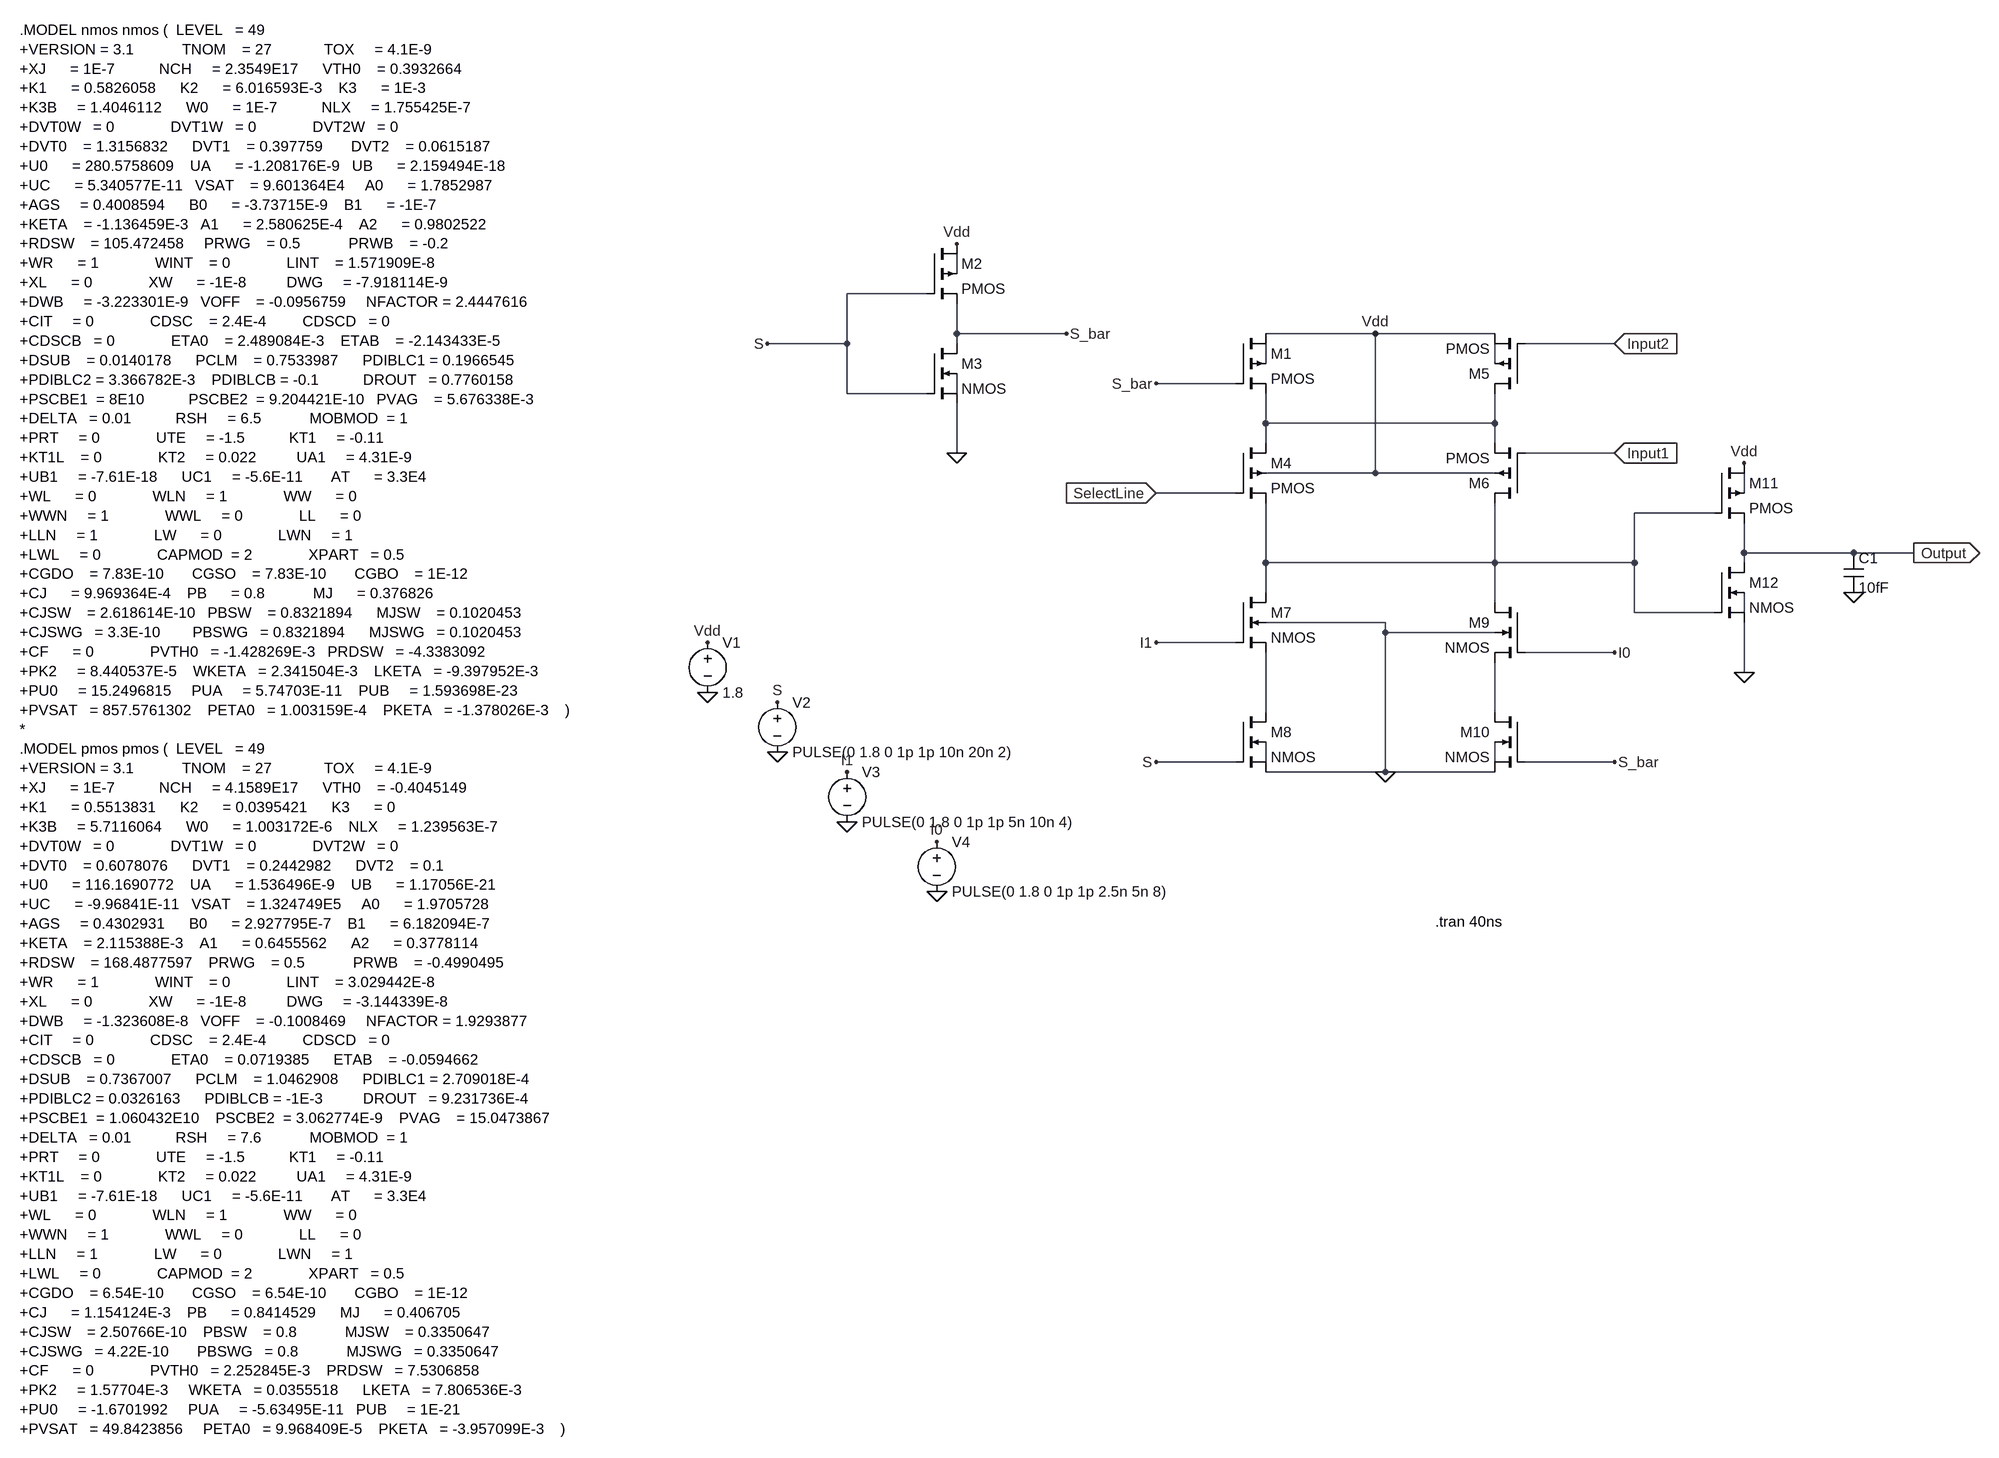
[diagram p0: schematic mux21.asc]
mux21.asc, the LTspice schematic file:
Version 4
SHEET 1 3156 1872
WIRE 528 -128 528 -160
WIRE 480 -96 352 -96
WIRE 528 -32 528 -80
WIRE 704 -32 528 -32
WIRE 1200 -32 1024 -32
WIRE 1392 -32 1200 -32
WIRE 352 -16 352 -96
WIRE 352 -16 224 -16
WIRE 528 -16 528 -32
WIRE 1584 -16 1440 -16
WIRE 1024 16 1024 -16
WIRE 1392 16 1392 -16
WIRE 976 48 848 48
WIRE 352 64 352 -16
WIRE 480 64 352 64
WIRE 528 64 528 32
WIRE 1024 112 1024 64
WIRE 1392 112 1392 64
WIRE 1392 112 1024 112
WIRE 1024 144 1024 112
WIRE 1392 144 1392 112
WIRE 528 160 528 80
WIRE 1584 160 1440 160
WIRE 1200 192 1200 -32
WIRE 1200 192 1024 192
WIRE 1392 192 1200 192
WIRE 976 224 848 224
WIRE 1792 224 1792 192
WIRE 1744 256 1616 256
WIRE 1792 320 1792 272
WIRE 1968 320 1792 320
WIRE 2064 320 1968 320
WIRE 1024 336 1024 240
WIRE 1392 336 1392 240
WIRE 1392 336 1024 336
WIRE 1616 336 1616 256
WIRE 1616 336 1392 336
WIRE 1792 336 1792 320
WIRE 1024 384 1024 336
WIRE 1392 400 1392 336
WIRE 1616 416 1616 336
WIRE 1744 416 1616 416
WIRE 1792 416 1792 384
WIRE 1216 432 1024 432
WIRE 1216 448 1216 432
WIRE 1392 448 1216 448
WIRE 976 464 848 464
WIRE 1584 480 1440 480
WIRE 1792 512 1792 432
WIRE 1024 576 1024 480
WIRE 1392 576 1392 496
WIRE 976 656 848 656
WIRE 1024 656 1024 624
WIRE 1392 656 1392 624
WIRE 1584 656 1440 656
WIRE 1216 672 1216 448
WIRE 1216 672 1024 672
WIRE 1392 672 1216 672
FLAG 528 160 0
FLAG 224 -16 S
FLAG 704 -32 S_bar
FLAG 528 -176 Vdd
FLAG 1968 384 0
FLAG 1216 672 0
FLAG 848 656 S
FLAG 848 464 I1
FLAG 1200 -32 Vdd
FLAG 848 48 S_bar
FLAG 1584 656 S_bar
FLAG 1584 480 I0
FLAG 1792 512 0
FLAG 1792 176 Vdd
FLAG 128 544 0
FLAG 240 640 0
FLAG 352 752 0
FLAG 496 864 0
FLAG 128 464 Vdd
FLAG 240 560 S
FLAG 352 672 I1
FLAG 496 784 I0
FLAG 1584 160 Input1
IOPIN 1584 160 In
FLAG 1584 -16 Input2
IOPIN 1584 -16 In
FLAG 2064 320 Output
IOPIN 2064 320 Out
FLAG 848 224 SelectLine
IOPIN 848 224 In
SYMBOL voltage 128 448 R0
SYMATTR InstName V1
SYMATTR Value 1.8
SYMBOL voltage 240 544 R0
SYMATTR InstName V2
SYMATTR Value PULSE(0 1.8 0 1p 1p 10n 20n 2)
SYMBOL voltage 352 656 R0
SYMATTR InstName V3
SYMATTR Value PULSE(0 1.8 0 1p 1p 5n 10n 4)
SYMBOL pmos4 480 -176 R0
SYMATTR InstName M2
SYMATTR Value2 l=180n w=360n
SYMBOL nmos4 480 -16 R0
SYMATTR InstName M3
SYMATTR Value2 l=180n w=360n
SYMBOL pmos4 976 -32 R0
SYMATTR InstName M1
SYMATTR Value2 l=180n w=360n
SYMBOL pmos4 976 144 R0
SYMATTR InstName M4
SYMATTR Value2 l=180n w=360n
SYMBOL pmos4 1440 64 R180
SYMATTR InstName M5
SYMATTR Value2 l=180n w=360n
SYMBOL pmos4 1440 240 R180
SYMATTR InstName M6
SYMATTR Value2 l=180n w=360n
SYMBOL nmos4 976 384 R0
SYMATTR InstName M7
SYMATTR Value2 l=180n w=360n
SYMBOL nmos4 976 576 R0
SYMATTR InstName M8
SYMATTR Value2 l=180n w=360n
SYMBOL nmos4 1440 400 M0
SYMATTR InstName M9
SYMATTR Value2 l=180n w=360n
SYMBOL nmos4 1440 576 M0
SYMATTR InstName M10
SYMATTR Value2 l=180n w=360n
SYMBOL cap 1952 320 R0
SYMATTR InstName C1
SYMATTR Value 10fF
SYMBOL pmos4 1744 176 R0
SYMATTR InstName M11
SYMATTR Value2 l=180n w=360n
SYMBOL nmos4 1744 336 R0
SYMATTR InstName M12
SYMATTR Value2 l=180n w=360n
SYMBOL voltage 496 768 R0
SYMATTR InstName V4
SYMATTR Value PULSE(0 1.8 0 1p 1p 2.5n 5n 8)
TEXT 1296 912 Left 2 !.tran 40ns
TEXT -976 -520 Left 2 !.MODEL nmos nmos (  LEVEL   = 49\n+VERSION = 3.1            TNOM    = 27             TOX     = 4.1E-9\n+XJ      = 1E-7           NCH     = 2.3549E17      VTH0    = 0.3932664\n+K1      = 0.5826058      K2      = 6.016593E-3    K3      = 1E-3\n+K3B     = 1.4046112      W0      = 1E-7           NLX     = 1.755425E-7\n+DVT0W   = 0              DVT1W   = 0              DVT2W   = 0\n+DVT0    = 1.3156832      DVT1    = 0.397759       DVT2    = 0.0615187\n+U0      = 280.5758609    UA      = -1.208176E-9   UB      = 2.159494E-18\n+UC      = 5.340577E-11   VSAT    = 9.601364E4     A0      = 1.7852987\n+AGS     = 0.4008594      B0      = -3.73715E-9    B1      = -1E-7\n+KETA    = -1.136459E-3   A1      = 2.580625E-4    A2      = 0.9802522\n+RDSW    = 105.472458     PRWG    = 0.5            PRWB    = -0.2\n+WR      = 1              WINT    = 0              LINT    = 1.571909E-8\n+XL      = 0              XW      = -1E-8          DWG     = -7.918114E-9\n+DWB     = -3.223301E-9   VOFF    = -0.0956759     NFACTOR = 2.4447616\n+CIT     = 0              CDSC    = 2.4E-4         CDSCD   = 0\n+CDSCB   = 0              ETA0    = 2.489084E-3    ETAB    = -2.143433E-5\n+DSUB    = 0.0140178      PCLM    = 0.7533987      PDIBLC1 = 0.1966545\n+PDIBLC2 = 3.366782E-3    PDIBLCB = -0.1           DROUT   = 0.7760158\n+PSCBE1  = 8E10           PSCBE2  = 9.204421E-10   PVAG    = 5.676338E-3\n+DELTA   = 0.01           RSH     = 6.5            MOBMOD  = 1\n+PRT     = 0              UTE     = -1.5           KT1     = -0.11\n+KT1L    = 0              KT2     = 0.022          UA1     = 4.31E-9\n+UB1     = -7.61E-18      UC1     = -5.6E-11       AT      = 3.3E4\n+WL      = 0              WLN     = 1              WW      = 0\n+WWN     = 1              WWL     = 0              LL      = 0\n+LLN     = 1              LW      = 0              LWN     = 1\n+LWL     = 0              CAPMOD  = 2              XPART   = 0.5\n+CGDO    = 7.83E-10       CGSO    = 7.83E-10       CGBO    = 1E-12\n+CJ      = 9.969364E-4    PB      = 0.8            MJ      = 0.376826\n+CJSW    = 2.618614E-10   PBSW    = 0.8321894      MJSW    = 0.1020453\n+CJSWG   = 3.3E-10        PBSWG   = 0.8321894      MJSWG   = 0.1020453\n+CF      = 0              PVTH0   = -1.428269E-3   PRDSW   = -4.3383092\n+PK2     = 8.440537E-5    WKETA   = 2.341504E-3    LKETA   = -9.397952E-3\n+PU0     = 15.2496815     PUA     = 5.74703E-11    PUB     = 1.593698E-23\n+PVSAT   = 857.5761302    PETA0   = 1.003159E-4    PKETA   = -1.378026E-3    )\n*\n.MODEL pmos pmos (  LEVEL   = 49\n+VERSION = 3.1            TNOM    = 27             TOX     = 4.1E-9\n+XJ      = 1E-7           NCH     = 4.1589E17      VTH0    = -0.4045149\n+K1      = 0.5513831      K2      = 0.0395421      K3      = 0\n+K3B     = 5.7116064      W0      = 1.003172E-6    NLX     = 1.239563E-7\n+DVT0W   = 0              DVT1W   = 0              DVT2W   = 0\n+DVT0    = 0.6078076      DVT1    = 0.2442982      DVT2    = 0.1\n+U0      = 116.1690772    UA      = 1.536496E-9    UB      = 1.17056E-21\n+UC      = -9.96841E-11   VSAT    = 1.324749E5     A0      = 1.9705728\n+AGS     = 0.4302931      B0      = 2.927795E-7    B1      = 6.182094E-7\n+KETA    = 2.115388E-3    A1      = 0.6455562      A2      = 0.3778114\n+RDSW    = 168.4877597    PRWG    = 0.5            PRWB    = -0.4990495\n+WR      = 1              WINT    = 0              LINT    = 3.029442E-8\n+XL      = 0              XW      = -1E-8          DWG     = -3.144339E-8\n+DWB     = -1.323608E-8   VOFF    = -0.1008469     NFACTOR = 1.9293877\n+CIT     = 0              CDSC    = 2.4E-4         CDSCD   = 0\n+CDSCB   = 0              ETA0    = 0.0719385      ETAB    = -0.0594662\n+DSUB    = 0.7367007      PCLM    = 1.0462908      PDIBLC1 = 2.709018E-4\n+PDIBLC2 = 0.0326163      PDIBLCB = -1E-3          DROUT   = 9.231736E-4\n+PSCBE1  = 1.060432E10    PSCBE2  = 3.062774E-9    PVAG    = 15.0473867\n+DELTA   = 0.01           RSH     = 7.6            MOBMOD  = 1\n+PRT     = 0              UTE     = -1.5           KT1     = -0.11\n+KT1L    = 0              KT2     = 0.022          UA1     = 4.31E-9\n+UB1     = -7.61E-18      UC1     = -5.6E-11       AT      = 3.3E4\n+WL      = 0              WLN     = 1              WW      = 0\n+WWN     = 1              WWL     = 0              LL      = 0\n+LLN     = 1              LW      = 0              LWN     = 1\n+LWL     = 0              CAPMOD  = 2              XPART   = 0.5\n+CGDO    = 6.54E-10       CGSO    = 6.54E-10       CGBO    = 1E-12\n+CJ      = 1.154124E-3    PB      = 0.8414529      MJ      = 0.406705\n+CJSW    = 2.50766E-10    PBSW    = 0.8            MJSW    = 0.3350647\n+CJSWG   = 4.22E-10       PBSWG   = 0.8            MJSWG   = 0.3350647\n+CF      = 0              PVTH0   = 2.252845E-3    PRDSW   = 7.5306858\n+PK2     = 1.57704E-3     WKETA   = 0.0355518      LKETA   = 7.806536E-3\n+PU0     = -1.6701992     PUA     = -5.63495E-11   PUB     = 1E-21\n+PVSAT   = 49.8423856     PETA0   = 9.968409E-5    PKETA   = -3.957099E-3    )

The netlist it stands for:
* mux21.asc
V1 Vdd 0 1.8
V2 S 0 PULSE(0 1.8 0 1p 1p 10n 20n 2)
V3 I1 0 PULSE(0 1.8 0 1p 1p 5n 10n 4)
M2 Vdd S S_bar N001 PMOS l=180n w=360n
M3 S_bar S 0 N004 NMOS l=180n w=360n
M1 Vdd S_bar N005 N002 PMOS l=180n w=360n
M4 N005 SelectLine N007 Vdd PMOS l=180n w=360n
M5 N005 Input2 Vdd N003 PMOS l=180n w=360n
M6 N007 Input1 N005 Vdd PMOS l=180n w=360n
M7 N007 I1 N009 0 NMOS l=180n w=360n
M8 N009 S 0 N011 NMOS l=180n w=360n
M9 N007 I0 N010 0 NMOS l=180n w=360n
M10 N010 S_bar 0 N012 NMOS l=180n w=360n
C1 Output 0 10fF
M11 Vdd N007 Output N006 PMOS l=180n w=360n
M12 Output N007 0 N008 NMOS l=180n w=360n
V4 I0 0 PULSE(0 1.8 0 1p 1p 2.5n 5n 8)
.model NMOS NMOS
.model PMOS PMOS
.lib standard.mos
.tran 40ns
.MODEL nmos nmos (  LEVEL   = 49
+VERSION = 3.1            TNOM    = 27             TOX     = 4.1E-9
+XJ      = 1E-7           NCH     = 2.3549E17      VTH0    = 0.3932664
+K1      = 0.5826058      K2      = 6.016593E-3    K3      = 1E-3
+K3B     = 1.4046112      W0      = 1E-7           NLX     = 1.755425E-7
+DVT0W   = 0              DVT1W   = 0              DVT2W   = 0
+DVT0    = 1.3156832      DVT1    = 0.397759       DVT2    = 0.0615187
+U0      = 280.5758609    UA      = -1.208176E-9   UB      = 2.159494E-18
+UC      = 5.340577E-11   VSAT    = 9.601364E4     A0      = 1.7852987
+AGS     = 0.4008594      B0      = -3.73715E-9    B1      = -1E-7
+KETA    = -1.136459E-3   A1      = 2.580625E-4    A2      = 0.9802522
+RDSW    = 105.472458     PRWG    = 0.5            PRWB    = -0.2
+WR      = 1              WINT    = 0              LINT    = 1.571909E-8
+XL      = 0              XW      = -1E-8          DWG     = -7.918114E-9
+DWB     = -3.223301E-9   VOFF    = -0.0956759     NFACTOR = 2.4447616
+CIT     = 0              CDSC    = 2.4E-4         CDSCD   = 0
+CDSCB   = 0              ETA0    = 2.489084E-3    ETAB    = -2.143433E-5
+DSUB    = 0.0140178      PCLM    = 0.7533987      PDIBLC1 = 0.1966545
+PDIBLC2 = 3.366782E-3    PDIBLCB = -0.1           DROUT   = 0.7760158
+PSCBE1  = 8E10           PSCBE2  = 9.204421E-10   PVAG    = 5.676338E-3
+DELTA   = 0.01           RSH     = 6.5            MOBMOD  = 1
+PRT     = 0              UTE     = -1.5           KT1     = -0.11
+KT1L    = 0              KT2     = 0.022          UA1     = 4.31E-9
+UB1     = -7.61E-18      UC1     = -5.6E-11       AT      = 3.3E4
+WL      = 0              WLN     = 1              WW      = 0
+WWN     = 1              WWL     = 0              LL      = 0
+LLN     = 1              LW      = 0              LWN     = 1
+LWL     = 0              CAPMOD  = 2              XPART   = 0.5
+CGDO    = 7.83E-10       CGSO    = 7.83E-10       CGBO    = 1E-12
+CJ      = 9.969364E-4    PB      = 0.8            MJ      = 0.376826
+CJSW    = 2.618614E-10   PBSW    = 0.8321894      MJSW    = 0.1020453
+CJSWG   = 3.3E-10        PBSWG   = 0.8321894      MJSWG   = 0.1020453
+CF      = 0              PVTH0   = -1.428269E-3   PRDSW   = -4.3383092
+PK2     = 8.440537E-5    WKETA   = 2.341504E-3    LKETA   = -9.397952E-3
+PU0     = 15.2496815     PUA     = 5.74703E-11    PUB     = 1.593698E-23
+PVSAT   = 857.5761302    PETA0   = 1.003159E-4    PKETA   = -1.378026E-3    )
*
.MODEL pmos pmos (  LEVEL   = 49
+VERSION = 3.1            TNOM    = 27             TOX     = 4.1E-9
+XJ      = 1E-7           NCH     = 4.1589E17      VTH0    = -0.4045149
+K1      = 0.5513831      K2      = 0.0395421      K3      = 0
+K3B     = 5.7116064      W0      = 1.003172E-6    NLX     = 1.239563E-7
+DVT0W   = 0              DVT1W   = 0              DVT2W   = 0
+DVT0    = 0.6078076      DVT1    = 0.2442982      DVT2    = 0.1
+U0      = 116.1690772    UA      = 1.536496E-9    UB      = 1.17056E-21
+UC      = -9.96841E-11   VSAT    = 1.324749E5     A0      = 1.9705728
+AGS     = 0.4302931      B0      = 2.927795E-7    B1      = 6.182094E-7
+KETA    = 2.115388E-3    A1      = 0.6455562      A2      = 0.3778114
+RDSW    = 168.4877597    PRWG    = 0.5            PRWB    = -0.4990495
+WR      = 1              WINT    = 0              LINT    = 3.029442E-8
+XL      = 0              XW      = -1E-8          DWG     = -3.144339E-8
+DWB     = -1.323608E-8   VOFF    = -0.1008469     NFACTOR = 1.9293877
+CIT     = 0              CDSC    = 2.4E-4         CDSCD   = 0
+CDSCB   = 0              ETA0    = 0.0719385      ETAB    = -0.0594662
+DSUB    = 0.7367007      PCLM    = 1.0462908      PDIBLC1 = 2.709018E-4
+PDIBLC2 = 0.0326163      PDIBLCB = -1E-3          DROUT   = 9.231736E-4
+PSCBE1  = 1.060432E10    PSCBE2  = 3.062774E-9    PVAG    = 15.0473867
+DELTA   = 0.01           RSH     = 7.6            MOBMOD  = 1
+PRT     = 0              UTE     = -1.5           KT1     = -0.11
+KT1L    = 0              KT2     = 0.022          UA1     = 4.31E-9
+UB1     = -7.61E-18      UC1     = -5.6E-11       AT      = 3.3E4
+WL      = 0              WLN     = 1              WW      = 0
+WWN     = 1              WWL     = 0              LL      = 0
+LLN     = 1              LW      = 0              LWN     = 1
+LWL     = 0              CAPMOD  = 2              XPART   = 0.5
+CGDO    = 6.54E-10       CGSO    = 6.54E-10       CGBO    = 1E-12
+CJ      = 1.154124E-3    PB      = 0.8414529      MJ      = 0.406705
+CJSW    = 2.50766E-10    PBSW    = 0.8            MJSW    = 0.3350647
+CJSWG   = 4.22E-10       PBSWG   = 0.8            MJSWG   = 0.3350647
+CF      = 0              PVTH0   = 2.252845E-3    PRDSW   = 7.5306858
+PK2     = 1.57704E-3     WKETA   = 0.0355518      LKETA   = 7.806536E-3
+PU0     = -1.6701992     PUA     = -5.63495E-11   PUB     = 1E-21
+PVSAT   = 49.8423856     PETA0   = 9.968409E-5    PKETA   = -3.957099E-3    )
.backanno
.end